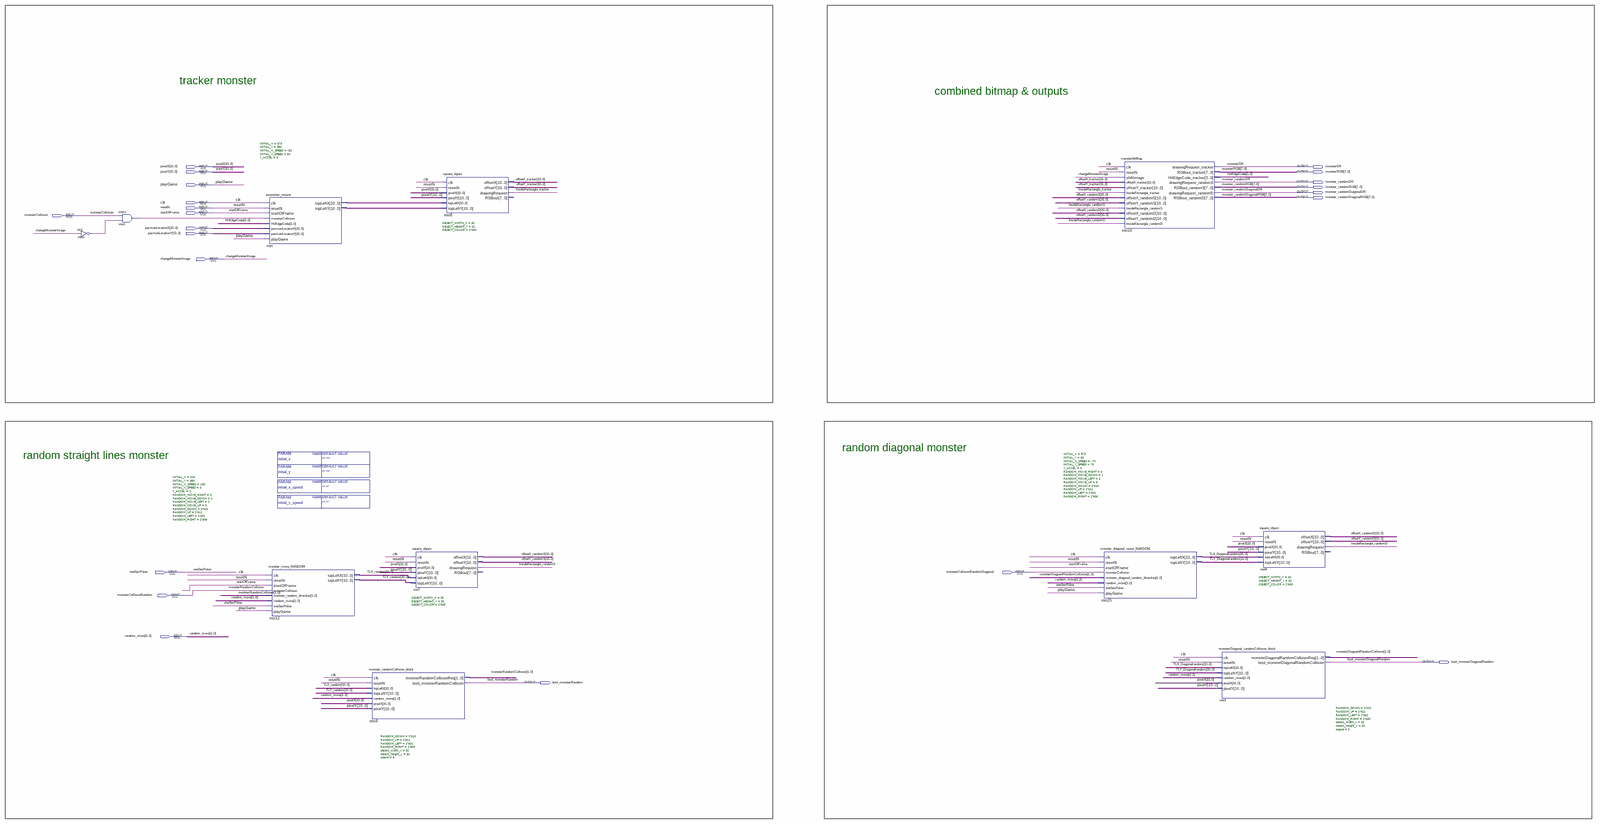
[diagram p0: schematic sheet, whole]
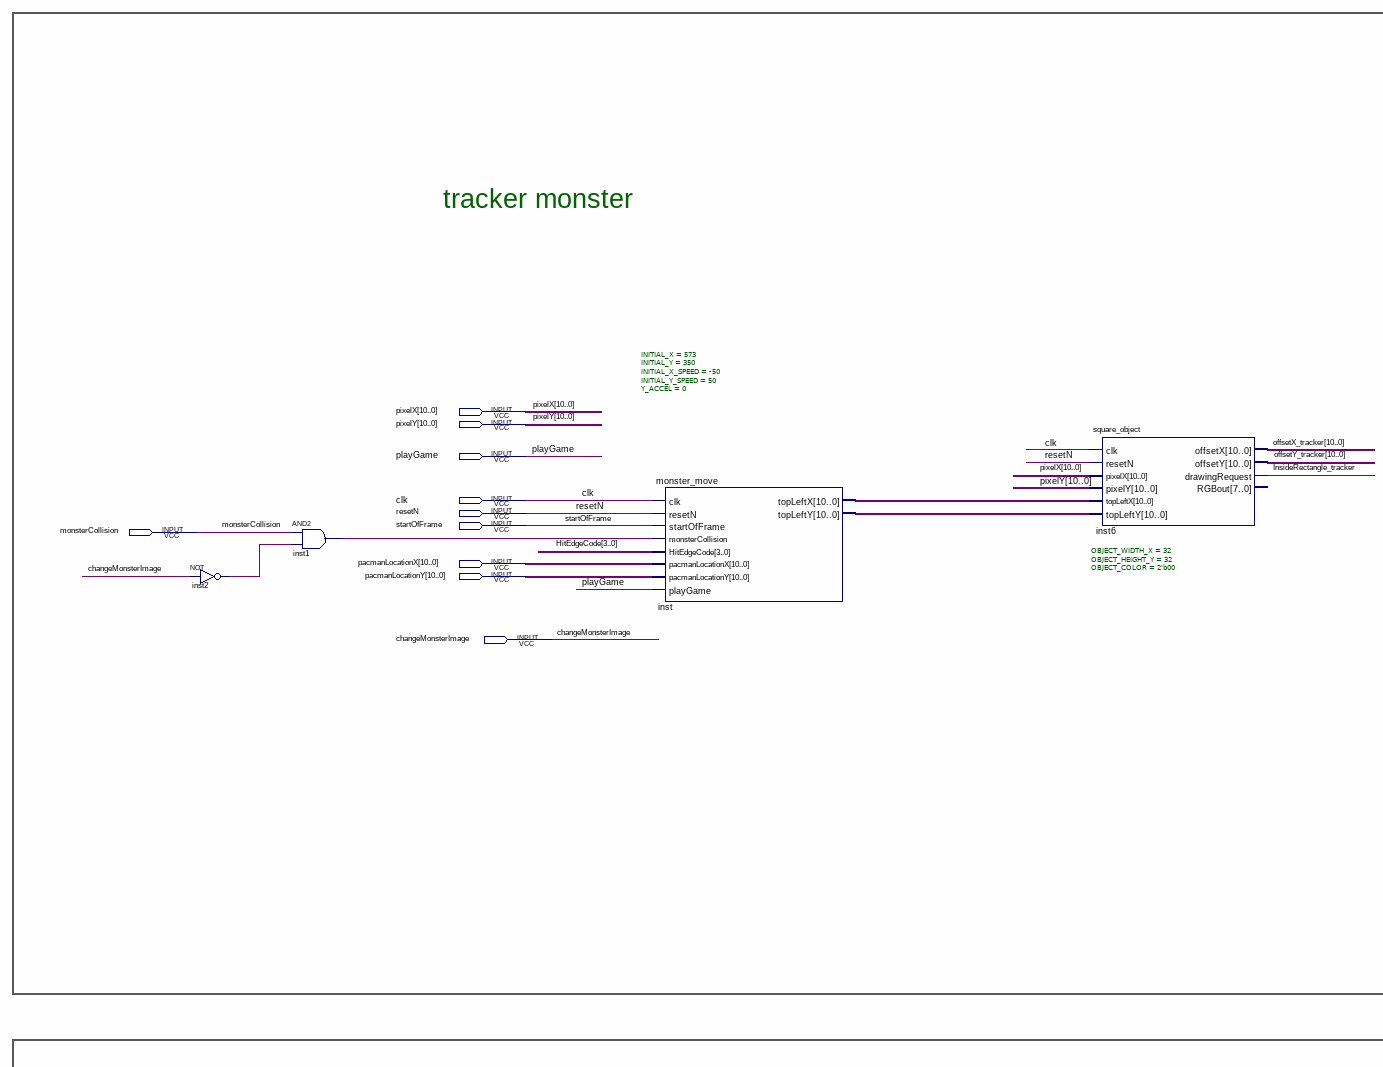
[diagram p1: schematic sheet, upper left part]
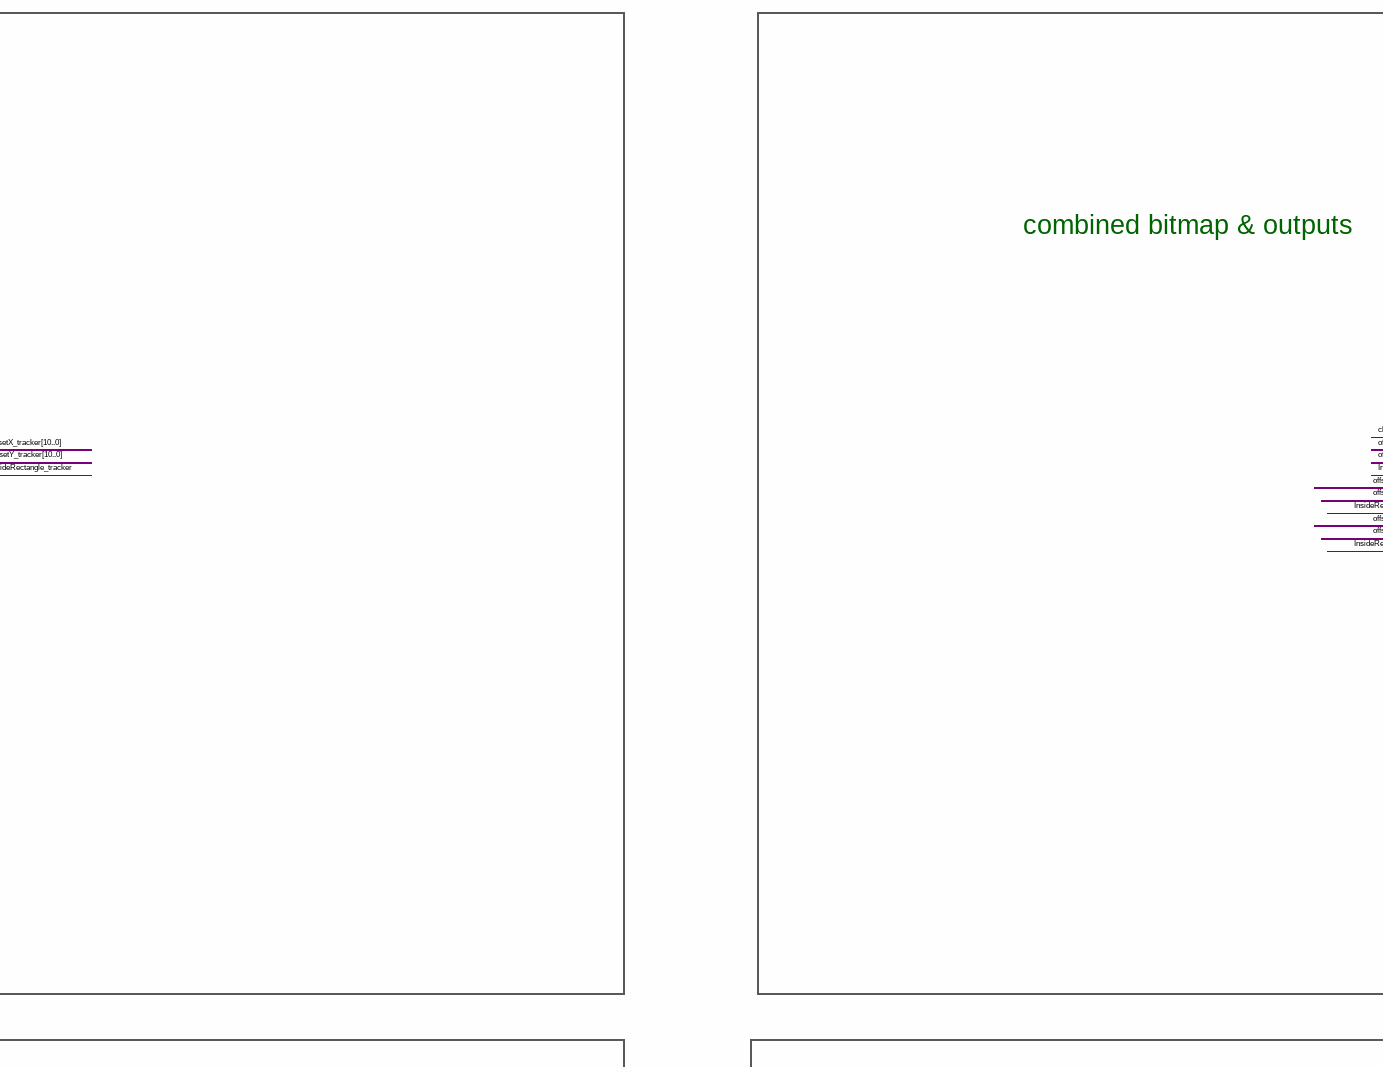
[diagram p2: schematic sheet, upper centre part]
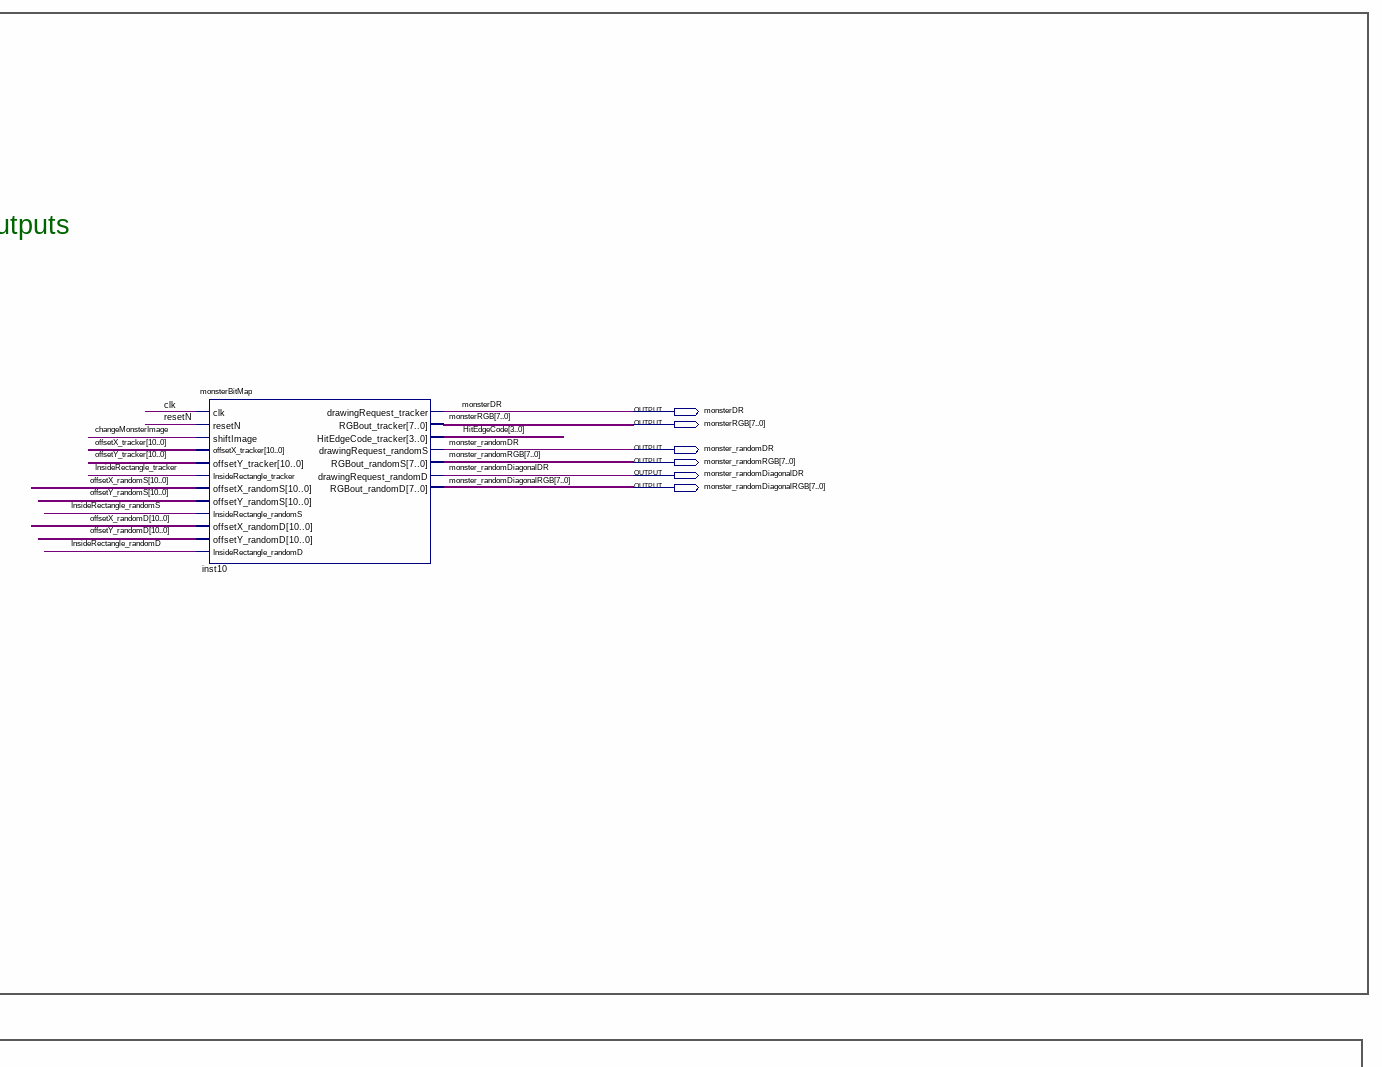
[diagram p3: schematic sheet, upper right part]
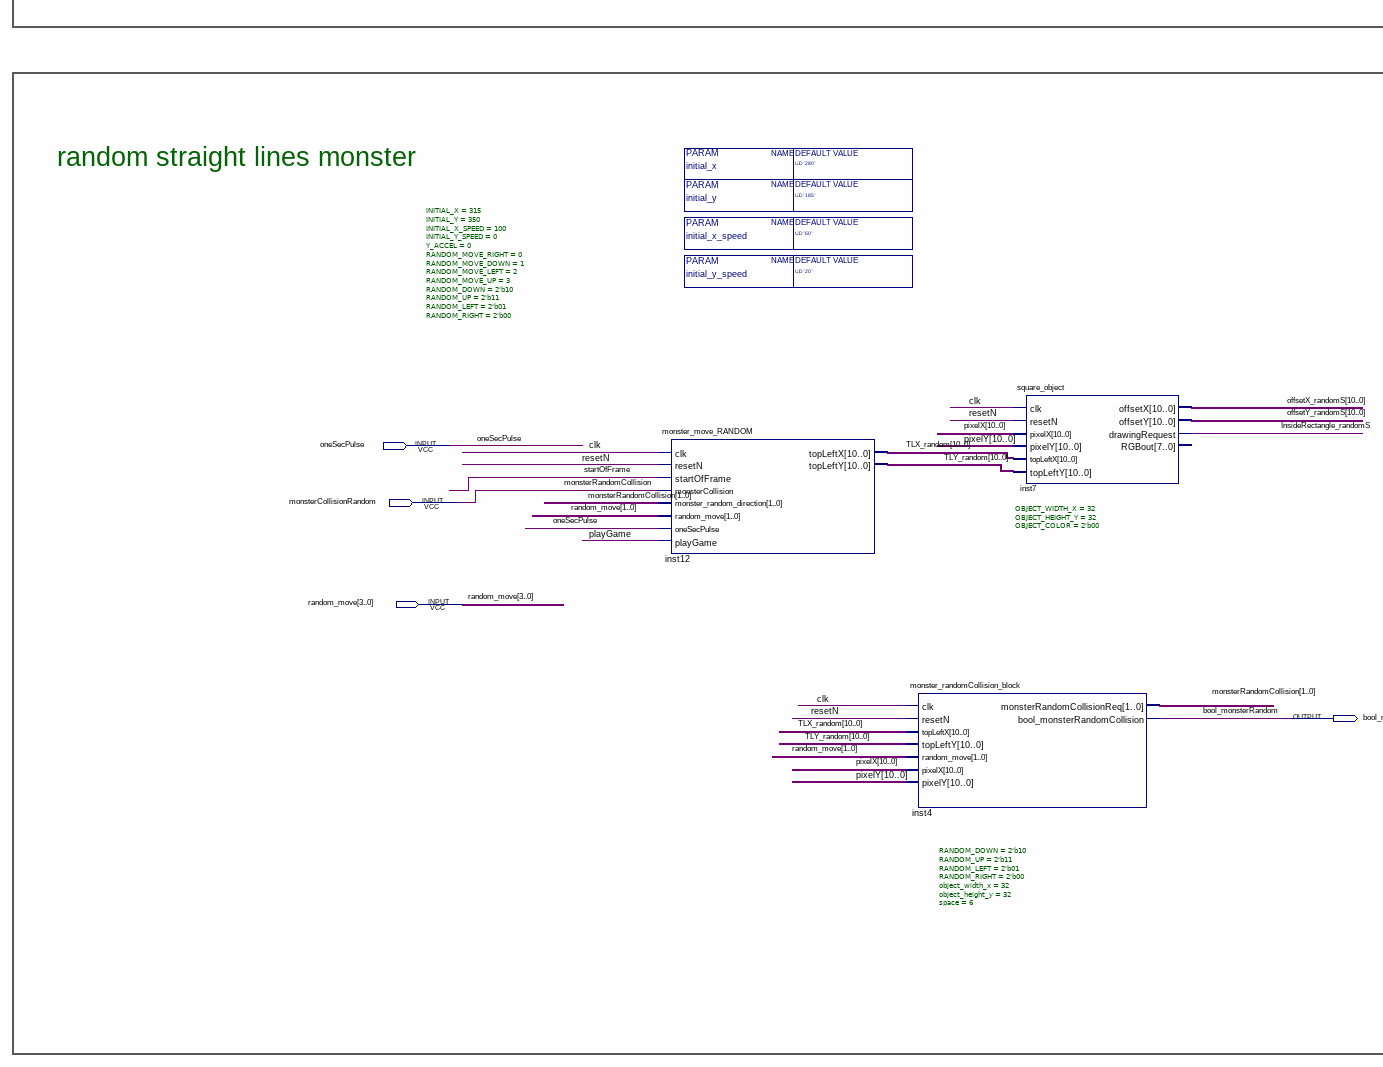
[diagram p4: schematic sheet, lower left part]
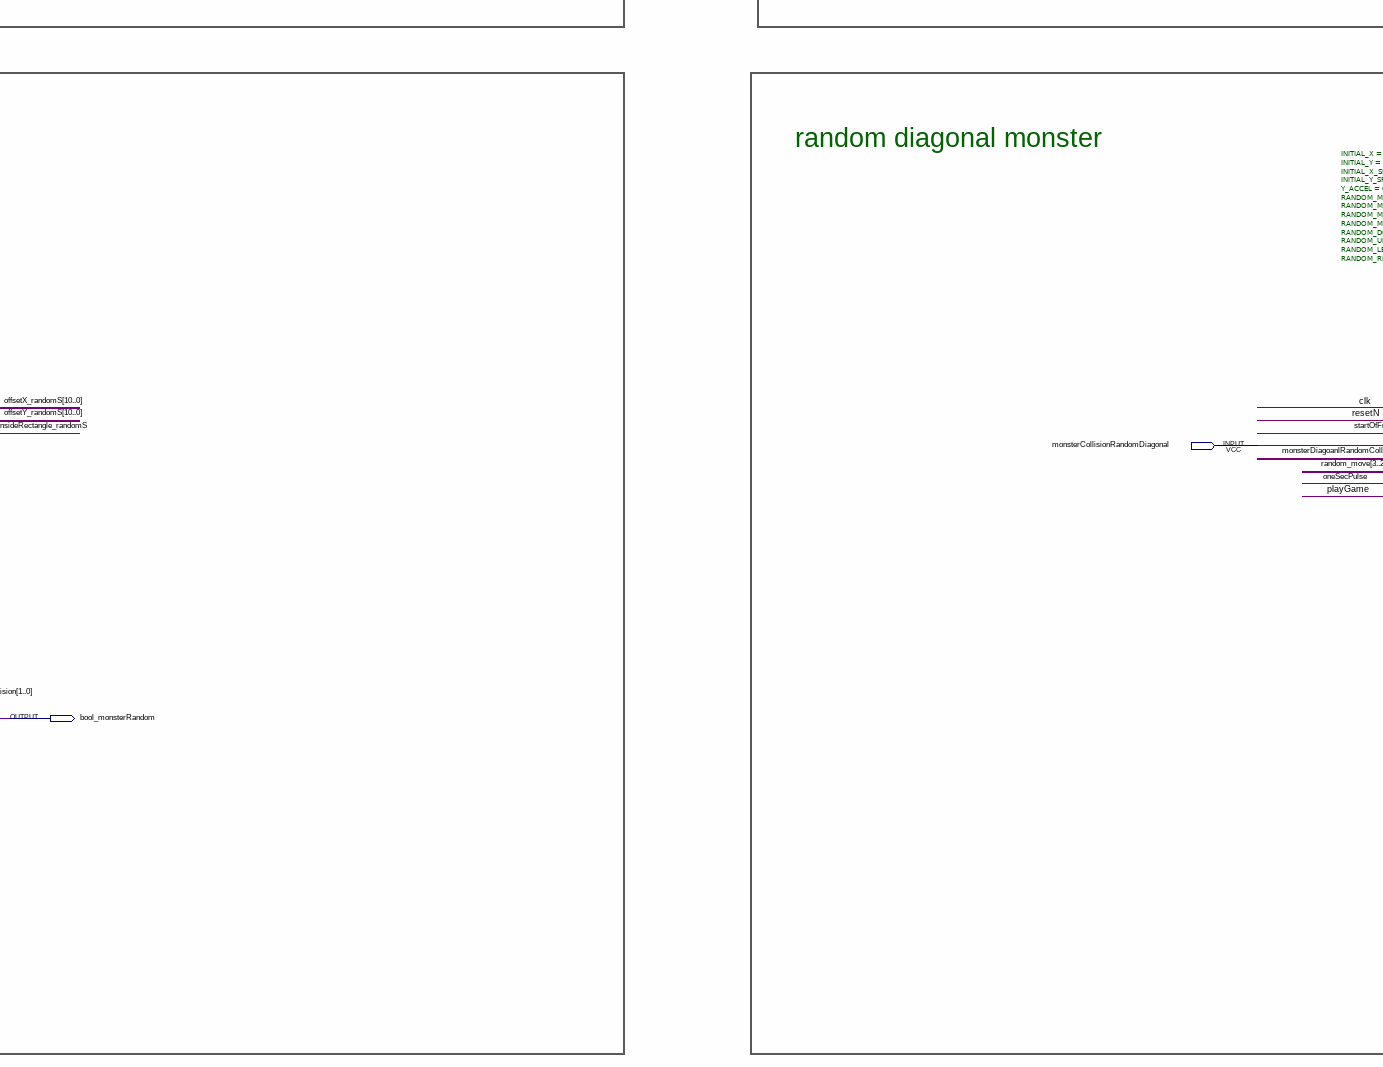
[diagram p5: schematic sheet, lower centre part]
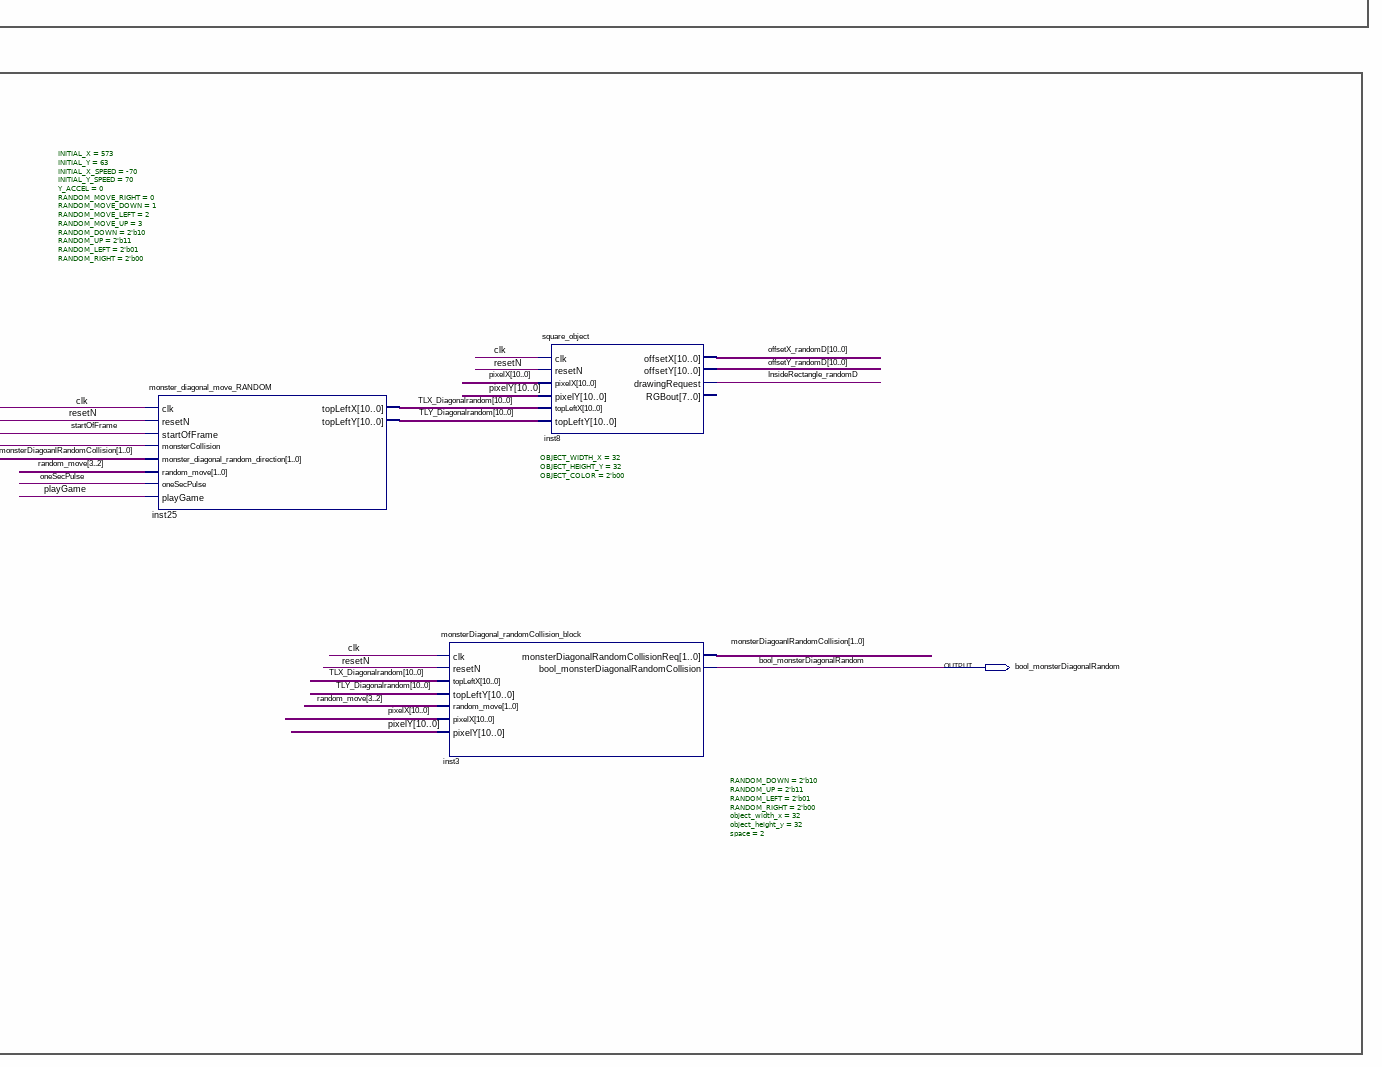
[diagram p6: schematic sheet, lower right part]
// Quartus schematic Monster_Block.bdf as structural Verilog: 11 symbols, 22 pins
module Monster_Block #(parameter initial_x = "UD\"280\"", parameter initial_y = "UD\"185\"", parameter initial_x_speed = "UD\"60\"", parameter initial_y_speed = "UD\"20\"") (
  input  [10:0] pixelX,
  input  [10:0] pixelY,
  input  playGame,
  input  clk,
  input  resetN,
  input  startOfFrame,
  input  monsterCollision,
  input  [10:0] pacmanLocationX,
  input  [10:0] pacmanLocationY,
  input  changeMonsterImage,
  input  oneSecPulse,
  input  monsterCollisionRandomDiagonal,
  input  monsterCollisionRandom,
  input  [3:0] random_move,
  output monsterDR,
  output [7:0] monsterRGB,
  output monster_randomDR,
  output [7:0] monster_randomRGB,
  output monster_randomDiagonalDR,
  output [7:0] monster_randomDiagonalRGB,
  output bool_monsterDiagonalRandom,
  output bool_monsterRandom
);

  wire InsideRectangle_randomD, InsideRectangle_randomS, InsideRectangle_tracker, inst1_out, inst2_out;
  wire [1:0] monsterDiagoanlRandomCollision, monsterRandomCollision;
  wire [3:0] HitEdgeCode;
  wire [10:0] inst_topleftx, inst_toplefty, offsetX_randomD, offsetX_randomS, offsetX_tracker,
       offsetY_randomD, offsetY_randomS, offsetY_tracker, TLX_Diagonalrandom, TLX_random, TLY_Diagonalrandom,
       TLY_random;

  not inst2 (inst2_out, changeMonsterImage);
  and inst1 (inst1_out, monsterCollision, inst2_out);
  monster_move #(.INITIAL_X(573), .INITIAL_Y(350), .INITIAL_X_SPEED(-50), .INITIAL_Y_SPEED(50), .Y_ACCEL(0)) inst (
    .clk(clk), .resetN(resetN), .startOfFrame(startOfFrame), .monsterCollision(inst1_out),
    .HitEdgeCode(HitEdgeCode), .pacmanLocationX(pacmanLocationX), .pacmanLocationY(pacmanLocationY),
    .playGame(playGame), .topLeftX(inst_topleftx), .topLeftY(inst_toplefty));
  monster_move_RANDOM #(.INITIAL_X(315), .INITIAL_Y(350), .INITIAL_X_SPEED(100), .INITIAL_Y_SPEED(0), .Y_ACCEL(0), .RANDOM_MOVE_RIGHT(0), .RANDOM_MOVE_DOWN(1), .RANDOM_MOVE_LEFT(2), .RANDOM_MOVE_UP(3), .RANDOM_DOWN(2'b10), .RANDOM_UP(2'b11), .RANDOM_LEFT(2'b01), .RANDOM_RIGHT(2'b00)) inst12 (
    .clk(clk), .resetN(resetN), .startOfFrame(startOfFrame), .monsterCollision(monsterCollisionRandom),
    .monster_random_direction(monsterRandomCollision), .random_move(random_move[1:0]),
    .oneSecPulse(oneSecPulse), .playGame(playGame), .topLeftX(TLX_random), .topLeftY(TLY_random));
  monster_randomCollision_block #(.RANDOM_DOWN(2'b10), .RANDOM_UP(2'b11), .RANDOM_LEFT(2'b01), .RANDOM_RIGHT(2'b00), .object_width_x(32), .object_height_y(32), .space(6)) inst4 (
    .clk(clk), .resetN(resetN), .topLeftX(TLX_random), .topLeftY(TLY_random), .random_move(random_move[1:0]),
    .pixelX(pixelX), .pixelY(pixelY), .monsterRandomCollisionReq(monsterRandomCollision),
    .bool_monsterRandomCollision(bool_monsterRandom));
  square_object #(.OBJECT_WIDTH_X(32), .OBJECT_HEIGHT_Y(32), .OBJECT_COLOR(2'b00)) inst7 (
    .clk(clk), .resetN(resetN), .pixelX(pixelX), .pixelY(pixelY), .topLeftX(TLX_random),
    .topLeftY(TLY_random), .offsetX(offsetX_randomS), .offsetY(offsetY_randomS),
    .drawingRequest(InsideRectangle_randomS));  // open: RGBout
  square_object #(.OBJECT_WIDTH_X(32), .OBJECT_HEIGHT_Y(32), .OBJECT_COLOR(2'b00)) inst6 (
    .clk(clk), .resetN(resetN), .pixelX(pixelX), .pixelY(pixelY), .topLeftX(inst_topleftx),
    .topLeftY(inst_toplefty), .offsetX(offsetX_tracker), .offsetY(offsetY_tracker),
    .drawingRequest(InsideRectangle_tracker));  // open: RGBout
  monster_diagonal_move_RANDOM #(.INITIAL_X(573), .INITIAL_Y(63), .INITIAL_X_SPEED(-70), .INITIAL_Y_SPEED(70), .Y_ACCEL(0), .RANDOM_MOVE_RIGHT(0), .RANDOM_MOVE_DOWN(1), .RANDOM_MOVE_LEFT(2), .RANDOM_MOVE_UP(3), .RANDOM_DOWN(2'b10), .RANDOM_UP(2'b11), .RANDOM_LEFT(2'b01), .RANDOM_RIGHT(2'b00)) inst25 (
    .clk(clk), .resetN(resetN), .startOfFrame(startOfFrame),
    .monsterCollision(monsterCollisionRandomDiagonal),
    .monster_diagonal_random_direction(monsterDiagoanlRandomCollision), .random_move(random_move[3:2]),
    .oneSecPulse(oneSecPulse), .playGame(playGame), .topLeftX(TLX_Diagonalrandom),
    .topLeftY(TLY_Diagonalrandom));
  monsterBitMap inst10 (
    .clk(clk), .resetN(resetN), .shiftImage(changeMonsterImage), .offsetX_tracker(offsetX_tracker),
    .offsetY_tracker(offsetY_tracker), .InsideRectangle_tracker(InsideRectangle_tracker),
    .offsetX_randomS(offsetX_randomS), .offsetY_randomS(offsetY_randomS),
    .InsideRectangle_randomS(InsideRectangle_randomS), .offsetX_randomD(offsetX_randomD),
    .offsetY_randomD(offsetY_randomD), .InsideRectangle_randomD(InsideRectangle_randomD),
    .drawingRequest_tracker(monsterDR), .RGBout_tracker(monsterRGB), .HitEdgeCode_tracker(HitEdgeCode),
    .drawingRequest_randomS(monster_randomDR), .RGBout_randomS(monster_randomRGB),
    .drawingRequest_randomD(monster_randomDiagonalDR), .RGBout_randomD(monster_randomDiagonalRGB));
  monsterDiagonal_randomCollision_block #(.RANDOM_DOWN(2'b10), .RANDOM_UP(2'b11), .RANDOM_LEFT(2'b01), .RANDOM_RIGHT(2'b00), .object_width_x(32), .object_height_y(32), .space(2)) inst3 (
    .clk(clk), .resetN(resetN), .topLeftX(TLX_Diagonalrandom), .topLeftY(TLY_Diagonalrandom),
    .random_move(random_move[3:2]), .pixelX(pixelX), .pixelY(pixelY),
    .monsterDiagonalRandomCollisionReq(monsterDiagoanlRandomCollision),
    .bool_monsterDiagonalRandomCollision(bool_monsterDiagonalRandom));
  square_object #(.OBJECT_WIDTH_X(32), .OBJECT_HEIGHT_Y(32), .OBJECT_COLOR(2'b00)) inst8 (
    .clk(clk), .resetN(resetN), .pixelX(pixelX), .pixelY(pixelY), .topLeftX(TLX_Diagonalrandom),
    .topLeftY(TLY_Diagonalrandom), .offsetX(offsetX_randomD), .offsetY(offsetY_randomD),
    .drawingRequest(InsideRectangle_randomD));  // open: RGBout

  // Other names for the same wires on the sheet: monsterRandomCollision = monsterCollisionRandom

  // Notes on the sheet:
  //   tracker monster         
  //   combined bitmap & outputs     
  //   random diagonal monster         
  //   random straight lines monster         
endmodule
